# Altium schematic sheet main.SchDoc
size 420 x 297 mm; SheetNumber: 1; SheetTotal: 6
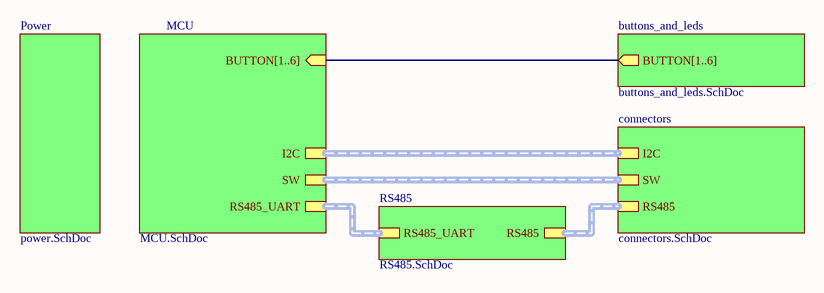
[diagram p0: main.SchDoc]

## Sub-sheets
buttons_and_leds = buttons_and_leds.SchDoc: BUTTON[1..6] (out)
connectors = connectors.SchDoc: SW (harness SW), I2C (harness I2C), RS485 (harness RS485)
MCU = MCU.SchDoc: BUTTON[1..6] (in), SW (harness SW), I2C (harness I2C), RS485_UART (harness RS_UART)
Power = power.SchDoc: no entries
RS485 = RS485.SchDoc: RS485_UART (harness RS_UART), RS485 (harness RS485)

## Buses and harness runs
bus sheet buttons_and_leds/BUTTON[1..6] = sheet MCU/BUTTON[1..6]
harness sheet connectors/I2C = sheet MCU/I2C
harness sheet connectors/RS485 = sheet RS485/RS485
harness sheet connectors/SW = sheet MCU/SW
harness sheet MCU/RS485_UART = sheet RS485/RS485_UART

## Notes on the sheet
- Перв. примен.
- Справ. №
- Подп. и дата
- Инв. № дубл.
- Взам. инв. №
- Разраб.
- Изм.
- Лист
- № докум.
- Подп.
- Дата
- Лит.
- Масса
- Масштаб
- Пров.
- Т.контр.
- Схема электрическая принципиальная
- Листов
- Инв. № подл.
- Утв.
- Н.контр.
- Копировал
- Формат А3